# EAGLE design seven_seg_thermocouple_two (EAGLE 7.6.0)
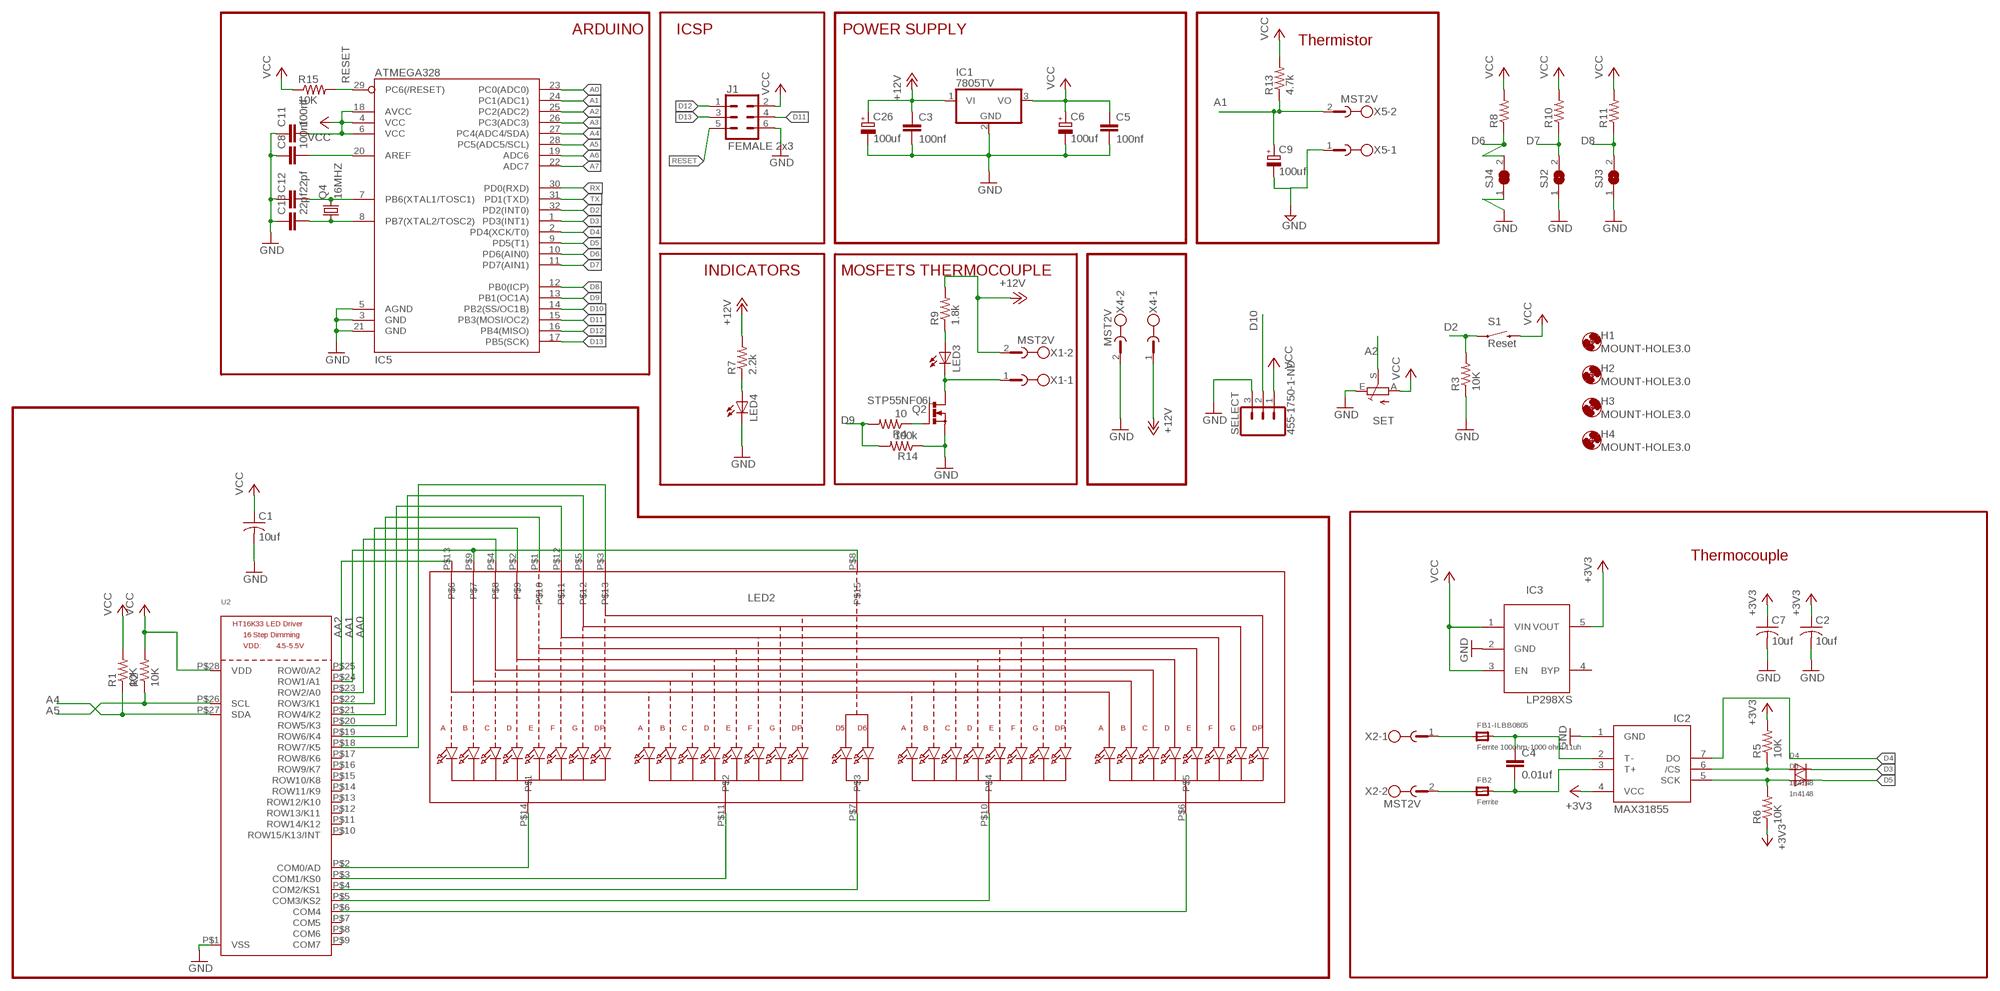
[diagram p0: schematic, sheet 1]

## Parts
C1  10uf  C-USC1206  [C1206]
C2  10uf  C-USC1206  [C1206]
C3  100nf  C-EUC1206  [C1206]
C4  0.01uf  C-EUC1206  [C1206]
C5  100nf  C-EUC1206  [C1206]
C6  100uf  CPOL-EUD  [PANASONIC_D]
C7  10uf  C-USC1206  [C1206]
C8  100nf  C-EUC1206  [C1206]
C9  100uf  CPOL-EUD  [PANASONIC_D]
C11  100nf  C-EUC1206  [C1206]
C12  22pf  C-EUC1206  [C1206]
C13  22pf  C-EUC1206  [C1206]
C26  100uf  CPOL-EUD  [PANASONIC_D]
D3  1n4148  DIODESOD-123  [SOD-123]
D4  1n4148  DIODESOD-123  [SOD-123]
FB1-ILBB0805  Ferrite 100ohm-1000 ohm 11uh  FERRITE_0805  [_0805]
FB2  Ferrite  FERRITE_0805  [_0805]
H1  MOUNT-HOLE3.0  [3,0]
H2  MOUNT-HOLE3.0  [3,0]
H3  MOUNT-HOLE3.0  [3,0]
H4  MOUNT-HOLE3.0  [3,0]
IC1  7805TV  [TO220V]
IC2  MAX31855  MAX6675  [SO08]
IC3  LP298XS  [SOT23-5L]
IC5  ATMEGA328  ATMEGA168  [TQFP32-08]
J1  FEMALE 2x3  CONN_03X2FEMALE  [2X3]
LED2  DISP_SEGMENT_4DIGIT_BL-Q56C43  [SEGMENT-BL-Q56C43]
LED3  LEDCHIPLED_1206  [CHIPLED_1206]
LED4  LEDCHIPLED_1206  [CHIPLED_1206]
Q2  STP55NF06L  IRF512  [TO220BV]
Q4  16MHZ  CRYSTALHC49S  [HC49/S]
R1  10K  R-US_R1206  [R1206]
R2  10K  R-US_R1206  [R1206]
R3  10K  R-US_R1206  [R1206]
R4  10  R-US_R1206  [R1206]
R5  10K  R-US_R1206  [R1206]
R6  10K  R-US_R1206  [R1206]
R7  2.2k  R-US_R1206  [R1206]
R8  R-US_R1206  [R1206]
R9  1.8k  R-US_R1206  [R1206]
R10  R-US_R1206  [R1206]
R11  R-US_R1206  [R1206]
R13  4.7k  R-US_R1206  [R1206]
R14  100k  R-US_R1206  [R1206]
R15  10K  R-US_R1206  [R1206]
S1  Reset  SWITCH-MOMENTARY-2SMD-ALT01  [TACTILE-SWITCH-SMD-ALT01]
SELECT  455-1750-1-ND  CONN_03  [1X03]
SET  TRIM_EU-B25U  [B25U]
SJ2  SJ  [SJ]
SJ3  SJ  [SJ]
SJ4  SOLDERJUMPER_CLOSED  [SOLDERJUMPER_CLOSEDWIRE]
U2  HT16K33_SOP28  [SOP28_300MIL]
X1  MST2V  [MSTBV2]
X2  MST2V  [MSTBV2]
X4  MST2V  [MSTBV2]
X5  MST2V  [MSTBV2]

## Nets
+3V3: C2.1 C7.1 IC2.4(VCC) IC3.5(VOUT) R5.2 R6.1
+12V [motors]: C3.1 C26.+ IC1.1(VI) R7.2 R9.2 X1.2 X4.1
A0: IC5.23(PC0(ADC0))
A1: C9.+ IC5.24(PC1(ADC1)) R13.1 X5.2
A2: IC5.25(PC2(ADC2)) SET.S
A3: IC5.26(PC3(ADC3))
A4: IC5.27(PC4(ADC4/SDA)) R1.1 U2.P$27(SDA)
A5: IC5.28(PC5(ADC5/SCL)) R2.1 U2.P$26(SCL)
A6: IC5.19(ADC6)
A7: IC5.22(ADC7)
AA0: LED2.P$4 U2.P$23(ROW2/A0)
AA1: LED2.P$8 LED2.P$9 U2.P$24(ROW1/A1)
AA2: LED2.P$13 U2.P$25(ROW0/A2)
CS: D4.A IC2.6(/CS) R5.1
D2: IC5.32(PD2(INT0)) R3.2 S1.1 S1.2
D3: D4.C IC5.1(PD3(INT1))
D4: IC2.7(DO) IC5.2(PD4(XCK/T0))
D5: D3.C IC5.9(PD5(T1))
D6: IC5.10(PD6(AIN0)) R8.1 SJ4.2
D7: IC5.11(PD7(AIN1)) R10.1 SJ2.2
D8: IC5.12(PB0(ICP)) R11.1 SJ3.2
D9: IC5.13(PB1(OC1A)) R4.2 R14.2
D10: IC5.14(PB2(SS/OC1B)) SELECT.2
D11: IC5.15(PB3(MOSI/OC2)) J1.4
D12: IC5.16(PB4(MISO)) J1.1
D13: IC5.17(PB5(SCK)) J1.3
GND [motors]: C1.2 C2.2 C3.2 C5.2 C6.- C7.2 C8.1 C9.- C11.1 C12.1 C13.1 C26.- IC1.2(GND) IC2.1(GND) IC3.2(GND) IC5.3(GND) IC5.5(AGND) IC5.21(GND) J1.6 LED4.C Q2.S R3.1 R14.1 SELECT.3 SET.E SJ2.1 SJ3.1 SJ4.1 U2.P$1(VSS) X4.2 X5.1
N$1: FB1-ILBB0805.1 X2.1
N$2: LED2.P$14 U2.P$2(COM0/AD)
N$3: LED2.P$11 U2.P$3(COM1/KS0)
N$4: LED2.P$7 U2.P$4(COM2/KS1)
N$5: LED2.P$10 U2.P$5(COM3/KS2)
N$6: LED2.P$6 U2.P$6(COM4)
N$7 [motors]: LED3.C Q2.D X1.1
N$8: C4.1 FB1-ILBB0805.2 IC2.2(T-)
N$9: FB2.1 X2.2
N$10: LED2.P$2 U2.P$22(ROW3/K1)
N$11: LED2.P$1 U2.P$21(ROW4/K2)
N$12: LED2.P$12 U2.P$20(ROW5/K3)
N$13: LED2.P$5 U2.P$19(ROW6/K4)
N$14: C4.2 FB2.2 IC2.3(T+)
N$16: LED2.P$3 U2.P$18(ROW7/K5)
N$20: C8.2 IC5.20(AREF)
N$26: LED4.A R7.1
N$31: C12.2 IC5.7(PB6(XTAL1/TOSC1)) Q4.2
N$32: C13.2 IC5.8(PB7(XTAL2/TOSC2)) Q4.1
N$45: LED3.A R9.1
N$47: Q2.G R4.1
RESET: IC5.29(PC6(/RESET)) J1.5 R15.2
RX: IC5.30(PD0(RXD))
SCK: D3.A IC2.5(SCK) R6.2
TX: IC5.31(PD1(TXD))
VCC: C1.1 C5.1 C6.+ C11.2 IC1.3(VO) IC3.1(VIN) IC3.3(EN) IC5.4(VCC) IC5.6(VCC) IC5.18(AVCC) J1.2 R1.2 R2.2 R8.2 R10.2 R11.2 R13.2 R15.1 S1.3 S1.4 SELECT.1 SET.A U2.P$28(VDD)
Unconnected: IC3.4(BYP) U2.P$7(COM5) U2.P$8(COM6) U2.P$9(COM7) U2.P$10(ROW15/K13/INT) U2.P$11(ROW14/K12) U2.P$12(ROW13/K11) U2.P$13(ROW12/K10) U2.P$14(ROW11/K9) U2.P$15(ROW10/K8) U2.P$16(ROW9/K7) U2.P$17(ROW8/K6)

## Notes on the sheet
- ARDUINO | ICSP | POWER SUPPLY
- Thermistor
- INDICATORS | MOSFETS THERMOCOUPLE
- Thermocouple

## Library data of the parts
C1 C2 C7 = resistor:C-US: CAPACITOR, American symbol
C3-C5 C8 C11-C13 = resistor:C-EU: CAPACITOR, European symbol
C6 C9 C26 = resistor:CPOL-EU: POLARIZED CAPACITOR, European symbol
D3 D4 = adafruit:DIODE: Diode SMADIODE - SMA Surface Mount Package 20V 1A Schottky Diode Digikey: 641-1014-6-ND DO-1N4148 - Through Hole Small Current Diode SOD-123 20V 1 A (.5mV Vf) Schottky Diode - Digikey: MBRX120TPMSCT-ND SOD-323 10V 570mA (.38mV Vf, 3ns) Schottky Diode - Digikey: ZLLS410CT-ND SOD-523 30V 30mA Schottky Diode (RB751S-40TE61) - Digikey: RB751S-40TE61CT-ND SOT23-R/W - SOT23 Package (R = Solder Paste/Reflow Ovens, W = Hand-Soldering) BAT54Film 40V 300mA - Digikey: 497-7162-1-ND
FB1-ILBB0805 FB2 = microbuilder:FERRITE: Ferrite Bead 0603 MMZ1608B121C - 120 Ohm @ 100MHz, 600mA, 0.15 Ohm DC Resistance - Digikey: 445-2164-1-ND BK1608HW121-T - 120 Ohm, 600mA Ferrite Chip - Digikey: 587-1876-2-ND 0805 HZ0805B272R-10 - 2.7K Ohm @ 100MHz, 200mA, 0.8 Ohm DC Resistance - Digikey: 240-2504-1-ND (see also Murata BLM21BD272SN1L) MMZ2012Y152B - 1.5K Ohm @ 100MHz, 500mA, 0.4 Ohm DC Resistance - Digikey: 445-1560-1-ND - Mainly for high frequency (80-400MHz) MMZ2012R102A - 1K Ohm @ 100MHz, 500mA, 0.3 Ohm DC Resistance - Digikey: 445-1555-2-ND - More general purpose (10-200MHz)
H1-H4 = holes:MOUNT-HOLE: MOUNTING HOLE with drill center marker
IC1 = linear:78*: Positive VOLTAGE REGULATOR Source: http://cache.national.com/ds/LM/LM78L05.pdf http://www.fairchildsemi.com/ds/LM/LM7805.pdf
IC2 = adafruit:MAX6675
IC3 = adafruit:LP298X
IC5 = SparkFun:ATMEGA168
J1 = SparkFun-Connectors:CONN_03X2: Multi connection point. Often used as Generic Header-pin footprint for 0.1 inch spaced/style header connections You can populate with any combo of single row headers, but if you'd like an exact match, check these: Header - 2x3 (Male, 0.1") <https://www.sparkfun.com/products/12807> (PRT-12807) Header - 2x3 (Female, 0.1") <https://www.sparkfun.com/products/13010> (PRT-13010) 2x3 Pin Shrouded Header <https://www.sparkfun.com/products/10877> (PRT-10877) On any of the 0.1 inch spaced packages, you can populate with these: Break Away Headers - Straight <https://www.sparkfun.com/products/116> (PRT-00116) Break Away Male Headers - Right Angle <https://www.sparkfun.com/products/553> (PRT-00553) Female Headers <https://www.sparkfun.com/products/115> (PRT-00115) Break Away Headers - Machine Pin <https://www.sparkfun.com/products/117> (PRT-00117) Break Away Female Headers - Swiss Machine Pin <https://www.sparkfun.com/products/743> (PRT-00743) Special note: the shrouded connector mates well with our 3x2 ribbon cables: Ribbon Crimp Connector - 6-pin (2x3, Female) <https://www.sparkfun.com/products/10651> (PRT-10651) Ribbon Cable - 6 wire (15ft) <https://www.sparkfun.com/products/10646> (PRT-10646); PROD_ID: CONN-11566
LED2 = microbuilder:DISP_SEGMENT_4DIGIT_BL-Q56C43
LED3 LED4 = led:LED: LED OSRAM: - CHIPLED LG R971, LG N971, LY N971, LG Q971, LY Q971, LO R971, LY R971 LH N974, LH R974 LS Q976, LO Q976, LY Q976 LO Q996 - Hyper CHIPLED LW Q18S LB Q993, LB Q99A, LB R99A - SideLED LS A670, LO A670, LY A670, LG A670, LP A670 LB A673, LV A673, LT A673, LW A673 LH A674 LY A675 LS A676, LA A676, LO A676, LY A676, LW A676 LS A679, LY A679, LG A679 - Hyper Micro SIDELED® LS Y876, LA Y876, LO Y876, LY Y876 LT Y87S - SmartLED LW L88C, LW L88S LB L89C, LB L89S, LG L890 LS L89K, LO L89K, LY L89K LS L896, LA L896, LO L896, LY L896 - TOPLED LS T670, LO T670, LY T670, LG T670, LP T670 LSG T670, LSP T670, LSY T670, LOP T670, LYG T670 LG T671, LOG T671, LSG T671 LB T673, LV T673, LT T673, LW T673 LH T674 LS T676, LA T676, LO T676, LY T676, LB T676, LH T676, LSB T676, LW T676 LB T67C, LV T67C, LT T67C, LS T67K, LO T67K, LY T67K, LW E67C LS E67B, LA E67B, LO E67B, LY E67B, LB E67C, LV E67C, LT E67C LW T67C LS T679, LY T679, LG T679 LS T770, LO T770, LY T770, LG T770, LP T770 LB T773, LV T773, LT T773, LW T773 LH T774 LS E675, LA E675, LY E675, LS T675 LS T776, LA T776, LO T776, LY T776, LB T776 LHGB T686 LT T68C, LB T68C - Hyper Mini TOPLED® LB M676 - Mini TOPLED Santana® LG M470 LS M47K, LO M47K, LY M47K Source: http://www.osram.convergy.de LUXEON: - LUMILED® LXK2-PW12-R00, LXK2-PW12-S00, LXK2-PW14-U00, LXK2-PW14-V00 LXK2-PM12-R00, LXK2-PM12-S00, LXK2-PM14-U00 LXK2-PE12-Q00, LXK2-PE12-R00, LXK2-PE12-S00, LXK2-PE14-T00, LXK2-PE14-U00 LXK2-PB12-K00, LXK2-PB12-L00, LXK2-PB12-M00, LXK2-PB14-N00, LXK2-PB14-P00, LXK2-PB14-Q00 LXK2-PR12-L00, LXK2-PR12-M00, LXK2-PR14-Q00, LXK2-PR14-R00 LXK2-PD12-Q00, LXK2-PD12-R00, LXK2-PD12-S00 LXK2-PH12-R00, LXK2-PH12-S00 LXK2-PL12-P00, LXK2-PL12-Q00, LXK2-PL12-R00 Source: www.luxeon.com KINGBRIGHT: KA-3528ASYC Source: www.kingbright.com
Q2 = transistor-power:IRF512: N-CHANNEL MOS FET
Q4 = crystal:CRYSTAL: CRYSTAL
R1-R11 R13-R15 = resistor:R-US_: RESISTOR, American symbol
S1 = Testing:SWITCH-MOMENTARY-2: Various NO switches- pushbuttons, reed, etc
SELECT = SparkFun-Connectors:CONN_03: Multi connection point. Often used as Generic Header-pin footprint for 0.1 inch spaced/style header connections On any of the 0.1 inch spaced packages, you can populate with these: Break Away Headers - Straight <https://www.sparkfun.com/products/116> (PRT-00116) Break Away Male Headers - Right Angle <https://www.sparkfun.com/products/553> (PRT-00553) Female Headers <https://www.sparkfun.com/products/115> (PRT-00115) Break Away Headers - Machine Pin <https://www.sparkfun.com/products/117> (PRT-00117) Break Away Female Headers - Swiss Machine Pin <https://www.sparkfun.com/products/743> (PRT-00743) Stackable Header - 3 Pin (Female, 0.1") <https://www.sparkfun.com/products/13875> (PRT-13875) For SCREWTERMINALS and SPRING TERMINALS visit here: Screw Terimnals on SparkFun.com <https://www.sparkfun.com/search/results?term=Screw+Terminals> (5mm/3.5mm/2.54mm spacing) This device is also useful as a general connection point to wire up your design to another part of your project. Our various solder wires solder well into these plated through hole pads. Hook-Up Wire - Assortment (Stranded, 22 AWG) <https://www.sparkfun.com/products/11375> (PRT-11375) Hook-Up Wire - Assortment (Solid Core, 22 AWG) <https://www.sparkfun.com/products/11367> (PRT-11367) View the entire wire category on our website here <https://www.sparkfun.com/categories/141> Special notes: Molex polarized connector foot print use with SKU : PRT-08232 with associated crimp pins and housings.; PROD_ID: XXX-00000
SET = pot:TRIM_EU-: POTENTIOMETER
SJ2 SJ3 = jumper:SJ: SMD solder JUMPER
SJ4 = microbuilder:SOLDERJUMPER_CLOSED: Solder Jumper - Closed These solder jumpers are closed by default CLOSEDWIRE - 10 mil trace between pads that can be cut and resoldered later CLOSEDPERM - 63 mil trace between pads for a permanent connection (used to 'bridge' two signals, a shameless hack for Eagle). Can double as a test point as well (no cream layer)
U2 = microbuilder:HT16K33_SOP28
X1 X2 X4 X5 = con-phoenix-508:MST2V: PHOENIX

## Net classes
2 motors: width 1.016 mm

## Board
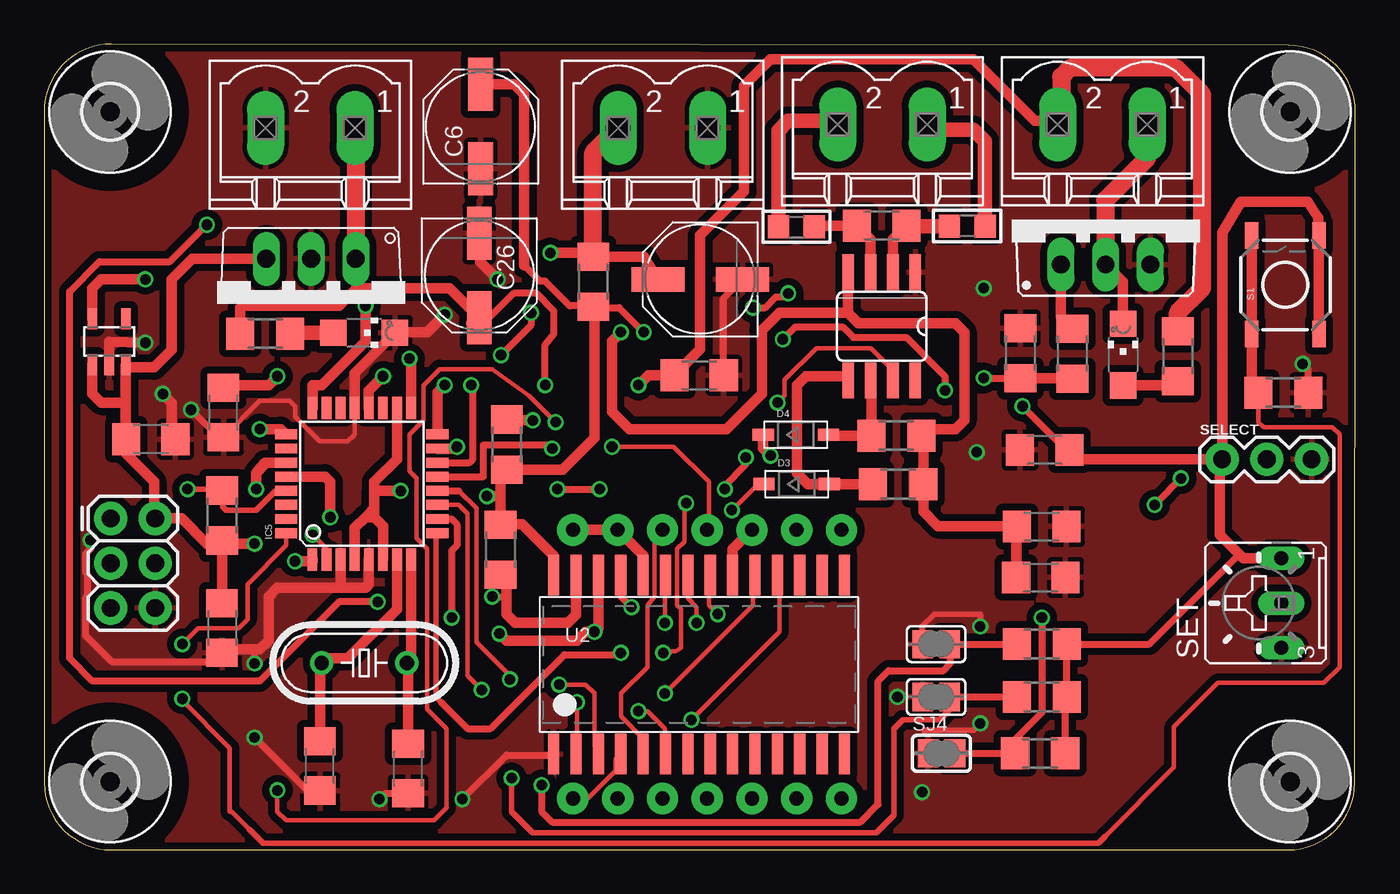
[diagram p1: board, top side]
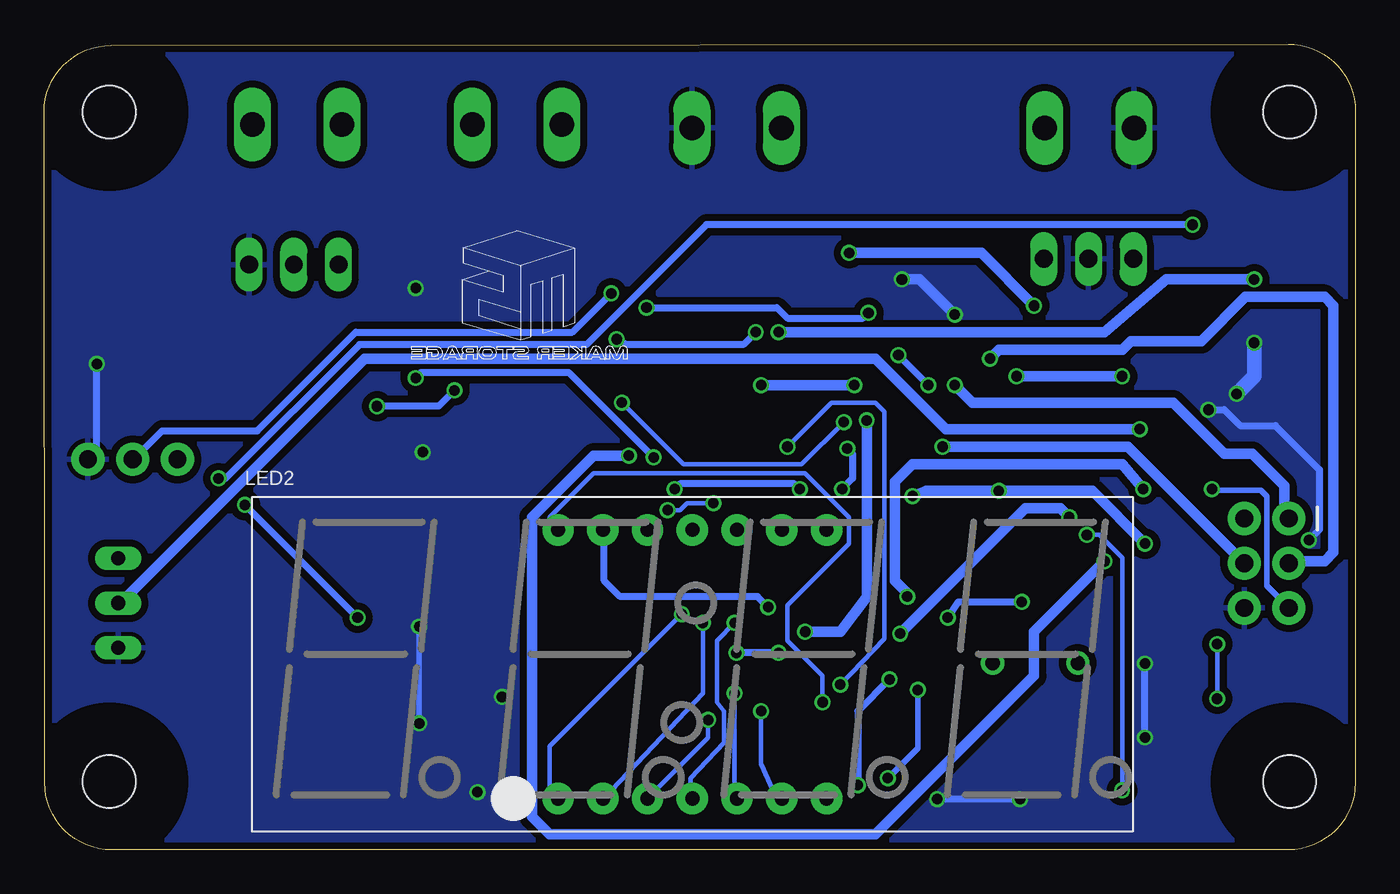
[diagram p2: board, bottom side, seen from below]

Size 74.45 x 45.73 mm. Coordinates in mm from the lower left corner, seen from the top.
Outline: 0,41.92 0.01,3.82 arc90 3.82,0 70.6,0 arc90 74.41,3.81 74.45,41.85 arc90 70.64,45.66 3.81,45.73 arc90 0,41.92
Copper layers (1*16): Top 0.035mm / dielectric 1.5mm / Bottom 0.035mm
Design rules "SeeedStudio_2layer_DRU_no_angle_20140221": minimum track width 6mil, minimum drill 12mil, track to track 6mil, track to pad 6mil, pad to pad 6mil, via to via 6mil, smd to smd 0mil, copper to edge 10mil, drill to drill 10mil, minimum pad ring 10mil, minimum via ring 6mil, stop-mask expansion 2mil, vias tented up to drill 100mil, thermal gap 10mil

### Footprints (pad centres in the part's own frame; a part is rotated, then mirrored left to right if it is on the bottom)
C1206 = smd 1.6 x 1.8: 1 -1.4,0; 2 1.4,0
PANASONIC_D = smd 3 x 1.4: + 2.4,0; - -2.4,0
SOD-123 = smd 1.2 x 0.7: A 1.85,0; C -1.85,0
_0805 = smd 1.2 x 1.3: 1 -1.016,0; 2 1.016,0
3,0 = hole 3: 0,0
TO220V = drill 1.016 long: 1 -2.54,-2.54; 2 0,-2.54; 3 2.54,-2.54
SO08 = smd 0.66 x 2.032: 1 -1.905,-3.073; 2 -0.635,-3.073; 3 0.635,-3.073; 4 1.905,-3.073; 5 1.905,3.073; 6 0.635,3.073; 7 -0.635,3.073; 8 -1.905,3.073
SOT23-5L = smd 0.55 x 1.2: 1 -0.95,-1.3; 2 0,-1.3; 3 0.95,-1.3; 4 0.95,1.3; 5 -0.95,1.3
TQFP32-08 = smd 1.27 x 0.559: 1 -4.293,2.8; 2 -4.293,2; 3 -4.293,1.2; 4 -4.293,0.4; 5 -4.293,-0.4; 6 -4.293,-1.2; 7 -4.293,-2; 8 -4.293,-2.8; 17 4.293,-2.8; 18 4.293,-2; 19 4.293,-1.2; 20 4.293,-0.4; 21 4.293,0.4; 22 4.293,1.2; 23 4.293,2; 24 4.293,2.8 | smd 0.559 x 1.27: 9 -2.8,-4.293; 10 -2,-4.293; 11 -1.2,-4.293; 12 -0.4,-4.293; 13 0.4,-4.293; 14 1.2,-4.293; 15 2,-4.293; 16 2.8,-4.293; 25 2.8,4.293; 26 2,4.293; 27 1.2,4.293; 28 0.4,4.293; 29 -0.4,4.293; 30 -1.2,4.293; 31 -2,4.293; 32 -2.8,4.293
2X3 = drill 1.016 pad 1.88: 1 0,0; 2 0,2.54; 3 2.54,0; 4 2.54,2.54; 5 5.08,0; 6 5.08,2.54
SEGMENT-BL-Q56C43 = drill 0.8 pad 1.778: P$1 -7.62,-7.62; P$2 -5.08,-7.62; P$3 -2.54,-7.62; P$4 0,-7.62; P$5 2.54,-7.62; P$6 5.08,-7.62; P$7 7.62,-7.62; P$8 7.62,7.62; P$9 5.08,7.62; P$10 2.54,7.62; P$11 0,7.62; P$12 -2.54,7.62; P$13 -5.08,7.62; P$14 -7.62,7.62
CHIPLED_1206 = smd 1.5 x 1.5: A 0,-1.75; C 0,1.75
TO220BV = drill 1.016 long: D 0,-2.54; G -2.54,-2.54; S 2.54,-2.54
HC49/S = drill 0.813: 1 -2.413,0; 2 2.413,0
R1206 = smd 1.6 x 1.803: 1 -1.422,0; 2 1.422,0
TACTILE-SWITCH-SMD-ALT01 = smd 1.524 x 0.762: 1 -2.794,1.905; 2 2.794,1.905; 3 -2.794,-1.905; 4 2.794,-1.905
1X03 = drill 1.016 pad 1.88: 1 0,0; 2 2.54,0; 3 5.08,0
B25U = drill 0.813 long: A 2.54,-0.889; E -2.54,-0.889; S 0,-0.889
SJ = smd 1.168 x 1.6: 1 -0.762,0; 2 0.762,0
SOLDERJUMPER_CLOSEDWIRE = smd 1.168 x 1.6: 1 -0.762,0; 2 0.762,0 | smd 0.635 x 0.203: WIRE 0,0
SOP28_300MIL = smd 0.635 x 2.286: P$1 -8.255,-5.08; P$2 -6.985,-5.08; P$3 -5.715,-5.08; P$4 -4.445,-5.08; P$5 -3.175,-5.08; P$6 -1.905,-5.08; P$7 -0.635,-5.08; P$8 0.635,-5.08; P$9 1.905,-5.08; P$10 3.175,-5.08; P$11 4.445,-5.08; P$12 5.715,-5.08; P$13 6.985,-5.08; P$14 8.255,-5.08; P$15 8.255,5.08; P$16 6.985,5.08; P$17 5.715,5.08; P$18 4.445,5.08; P$19 3.175,5.08; P$20 1.905,5.08; P$21 0.635,5.08; P$22 -0.635,5.08; P$23 -1.905,5.08; P$24 -3.175,5.08; P$25 -4.445,5.08; P$26 -5.715,5.08; P$27 -6.985,5.08; P$28 -8.255,5.08
MSTBV2 = drill 1.397 long: 1 -2.54,0; 2 2.54,0

### Placement (x,y rotation side)
C1  56.81,22.7 180 top
C2  56.64,18.36 0 top
C3  37.19,26.94 0 top
C4  47.56,35.42 180 top
C5  10.11,12.59 270 top
C6  24.79,41.05 90 top
C7  56.59,15.46 0 top
C8  10.19,24.82 90 top
C9  37.25,32.38 180 top
C11  6.06,23.3 180 top
C12  15.67,4.77 90 top
C13  20.67,4.62 90 top
C26  24.71,32.6 270 top
D3  42.73,20.76 0 top
D4  42.68,23.56 0 top
FB1-ILBB0805  52.41,35.4 180 top
FB2  42.71,35.36 0 top
H1  3.75,41.88 0 top
H2  3.75,3.88 0 top
H3  70.75,3.88 0 top
H4  70.75,41.88 0 top
IC1  15.16,31 180 top
IC2  47.56,29.71 180 top
IC3  3.7,28.84 0 top
IC5  18.04,20.78 90 top
J1  3.78,18.81 270 top
LED2  37.65,10.54 0 bottom
LED3  61.26,28.11 0 top
LED4  18.18,29.35 270 top
Q2  60.27,35.76 0 top
Q4  18.18,10.61 180 top
R1  25.92,17.04 90 top
R2  26.28,23 270 top
R3  70.35,25.95 180 top
R4  58.38,28.16 270 top
R5  48.39,23.51 0 top
R6  48.49,20.75 180 top
R7  12.56,29.3 180 top
R8  56.55,5.48 0 top
R9  64.37,28.02 90 top
R10  56.65,8.68 0 top
R11  56.65,11.68 0 top
R13  31.18,32.24 270 top
R14  55.43,28.19 270 top
R15  10.12,18.98 90 top
S1  70.47,32.07 90 top
SELECT  66.88,22.16 0 top
SET  69.35,14.01 90 top
SJ2  50.65,8.68 0 top
SJ3  50.65,11.68 0 top
SJ4  50.95,5.48 0 top
U2  37.19,10.52 0 top
X1  60.09,41.17 180 top
X2  47.6,41.17 180 top
X4  15.12,40.97 180 top
X5  35.13,40.97 180 top

### Tracks (layer width: path | path; a pad name or v marks a point on that pad's centre or on a via)
+3V3  (via drill 0.6)
  Top 0.61: C7.1 55.19,18.31 C2.1 55.22,18.38 50.75,18.38 49.91,19.21 R6.1 49.91,23.41 R5.2 50.18,23.88 51.75,23.88 52.25,24.38 52.25,29.38 51.75,29.88 46.25,29.88 45.65,30.47 | IC2.4 45.65,30.47 | 45.65,30.47 41.74,30.47 40.75,29.48 40.75,25.88 38.75,23.88 33.25,23.88 32.25,24.88 32.25,28.88 v32.75,29.38 | v5.75,32.38 3.25,32.38 2.75,31.88 IC3.5
  Bottom 0.61: v5.75,32.38 10.75,32.38 14.25,29.38 v32.75,29.38
+12V  (via drill 0.6)
  Top 0.406: v28.45,26.38 28.45,28.68 28.95,29.28 28.95,30.58 27.95,31.58 26.65,31.58 25.35,30.28 24.79,30.28 C26.+
  Top 0.61: R7.2 11.13,30.76 11.25,30.88 16.75,30.88 17.75,31.88 | 17.75,31.88 17.75,33.49 IC1.1 | 17.75,31.88 23.03,31.88 C26.+ 24.25,29.88 | X1.2 57.34,41.38 56.25,41.38 52.75,44.88 41.25,44.88 39.75,43.38 39.75,37.38 37.25,34.88 37.25,28.4 C3.1 34.31,26.94 v33.75,26.38
  Top 1.016: X4.1 17.7,40.97 IC1.1 | R9.2 64.37,30.5 65.75,31.88 65.75,42.88 64.25,44.38 58.25,44.38 57.75,43.88 57.75,41.37 X1.2
  Bottom 0.61: v28.45,26.38 v33.75,26.38
A1  (via drill 0.6)
  Top 0.61: C9.+ 34.06,33.66 R13.1 30.75,33.88 v28.75,33.88 | v18.25,30.88 18.25,28.88 15.75,26.38 15.25,26.38 15.25,25.38 IC5.24
  Top 1.016: R13.1 31.18,39.56 X5.2
  Bottom 0.61: v18.25,30.88 21.25,33.88 v28.75,33.88
A2  (via drill 0.6)
  Top 0.61: v12.25,23.88 13.44,23.88 IC5.25
  Bottom 0.61: v12.25,23.88 23.25,23.88 27.25,27.88 56.25,27.88 69.75,14.38 SET.S
A4  (via drill 0.6)
  Top 0.406: v25.45,14.38 26.15,14.38 26.25,14.48
  Top 0.61: U2.P$27 30.2,13.33 29.75,12.88 26.75,12.88 26.25,13.38 26.25,14.48 26.25,15.28 R1.1 | v12.05,20.48 12.05,21.38 12.55,21.98 IC5.27
  Bottom 0.61: v12.05,20.48 13.25,21.88 25.15,21.88 26.15,20.88 26.15,15.28 25.45,14.58 v25.45,14.38
A5  (via drill 0.6)
  Top 0.61: v27.75,24.38 26.25,24.38 R2.1 | U2.P$26 31.47,12.6 v31.25,12.38 30.75,12.38 30.25,11.88 26.25,11.88 v25.85,12.28 | IC5.28 15.95,21.18 16.25,20.88 v16.25,18.88
  Bottom 0.61: v27.75,24.38 27.75,14.38 29.25,12.38 v31.25,12.38 | v25.85,12.28 18.75,19.38 16.75,19.38 v16.25,18.88
AA0  (via drill 0.6)
  Top 0.254: v35.25,12.88 35.25,15.38 U2.P$23
  Bottom 0.254: v35.25,12.88 36.25,11.88 36.25,8.38 35.85,7.88 35.85,6.08 37.75,4.08 37.75,3.38 LED2.P$4
AA1
  Top 0.61: LED2.P$8 LED2.P$9 34.01,16.71 U2.P$24
AA2  (via drill 0.6)
  Top 0.406: v33.35,13.78 32.75,14.38 32.75,15.58 U2.P$25
  Bottom 0.406: v33.35,13.78 33.95,14.38 41.75,14.38 42.65,15.28 42.65,18.08 LED2.P$13
CS
  Top 0.61: IC2.6 46.96,26.59 R5.1 44.58,23.51 D4.A
D2  (via drill 0.6)
  Top 0.254: IC5.32 13.74,17.27 11.55,15.08 11.55,13.08 11.05,12.58 8.75,12.58 v7.85,11.68 | 7.85,8.68 v7.85,8.58 7.85,8.48 10.55,5.78 10.55,2.18 10.65,2.18 11.65,1.18 | 60.25,0.78 64.15,4.68 64.15,6.98 66.65,9.48 72.65,9.48 73.55,10.38 73.55,23.58 73.15,23.98 69.25,23.98 68.95,24.28 68.95,25.92 R3.2
  Top 0.305: 11.65,1.18 12.45,0.38 59.85,0.38 60.25,0.78
  Top 0.61: S1.2 S1.1 68.56,26.31 R3.2
  Bottom 0.254: v7.85,11.68 v7.85,8.58
D3  (via drill 0.6)
  Top 0.61: v14.25,16.38 15.25,16.38 IC5.1 | D4.C 40.83,22.8 v41.25,22.38
  Bottom 0.61: v14.25,16.38 18.25,12.38 18.25,9.88 27.25,0.88 45.75,0.88 46.75,1.88 46.75,18.88 43.25,22.38 v41.25,22.38
D4  (via drill 0.6)
  Top 0.254: v13.25,3.38 13.25,2.18 13.75,1.68 22.15,1.68 22.85,2.38 22.85,6.88 21.75,7.98 21.75,17.08 21.15,17.68 21.15,21.08 20.75,21.48 20.75,23.58 21.55,24.38 21.55,26.38 22.45,27.28 25.45,27.28 27.55,25.78 v29.05,24.28 | v15.25,17.88 16.05,17.08 16.05,16.58 IC5.2 | v41.65,25.38 42.05,25.78 42.05,26.68 43.85,28.48 46.95,28.48 48.15,27.28 48.15,26.68 IC2.7
  Bottom 0.254: v13.25,3.38 13.25,16.58 14.55,17.88 v15.25,17.88 | v41.65,25.38 38.15,21.88 31.45,21.88 v29.05,24.28
D5  (via drill 0.6)
  Top 0.254: v35.15,11.18 35.55,11.18 35.65,11.28 35.85,11.28 36.05,11.38 36.15,11.48 36.15,13.68 35.95,13.88 35.95,17.08 36.35,17.48 36.35,19.68 v36.45,19.68 | v39.05,19.28 40.55,20.78 40.85,20.78 D3.C
  Top 0.305: 22.55,8.38 22.25,8.68 22.25,17.89 IC5.9
  Top 0.406: 22.35,17.98 IC5.9 | 22.55,8.38 24.05,6.88 25.35,6.88 29.55,11.08 32.65,11.08 v32.75,11.18 | v35.15,11.18 35.35,11.18
  Bottom 0.254: v39.05,19.28 38.35,19.28 37.95,19.68 v36.45,19.68
  Bottom 0.406: v32.75,11.18 v35.15,11.18
D6  (via drill 0.6)
  Top 0.152: SJ4.2
  Top 0.406: 51.45,5.48 51.55,5.58 51.65,5.48 SJ4.2 R8.1 55.15,5.68 55.15,6.28 56.65,7.78 v56.65,13.18 | v64.55,21.08 v63.05,19.58 | v9.25,35.48 7.15,33.38 3.15,33.38 1.45,31.68 1.45,10.88 2.75,9.58 12.25,9.58 16.75,14.08 v18.95,14.08 | v23.15,13.18 23.15,16.98 23.45,17.28 23.45,18.48 23.15,18.78 IC5.10
  Bottom 0.406: v63.05,19.58 v56.65,13.18 | v64.55,21.08 64.15,21.08 56.55,28.68 43.65,28.68 36.85,35.48 v9.25,35.48 | v18.95,14.08 22.55,14.08 v23.15,13.18
D7  (via drill 0.6)
  Top 0.254: IC5.11 23.55,19.58 24.05,19.08 24.05,9.88 v24.85,9.08
  Top 0.305: v26.55,4.08 26.55,2.18 27.75,0.98 47.25,0.98 48.25,1.98 48.25,6.88 48.75,7.38 50.85,7.38 51.35,7.88 51.35,8.61 SJ2.2
  Top 0.406: R10.1 51.55,8.68 51.45,8.78 51.35,8.68 SJ2.2 | v24.85,9.08 24.85,9.28
  Bottom 0.305: v24.85,9.08 24.85,5.78 v26.55,4.08
D8  (via drill 0.6)
  Top 0.254: 23.55,20.38 24.55,19.38 24.55,11.78 26.45,9.88
  Top 0.406: R11.1 51.55,11.68 51.45,11.78 51.35,11.68 SJ3.2 51.45,11.64 51.45,10.58 51.05,10.18 47.95,10.18 47.35,9.58 47.35,2.58 46.35,1.58 28.85,1.58 28.25,2.18 v28.25,3.68 | IC5.12 23.55,20.38 | v26.45,9.68 26.45,9.88
  Bottom 0.406: v28.25,3.68 28.25,7.88 v26.45,9.68
D9  (via drill 0.6)
  Top 0.406: IC5.13 24.95,21.18 24.95,22.98 28.65,22.98 v28.85,22.78 | v53.35,26.78 55.15,26.78 R14.2 | v39.85,22.28 39.85,21.88 38.65,20.68 v38.65,20.48 | v29.15,20.48 v31.55,20.48
  Top 0.61: R14.2 58.35,26.76 R4.2
  Bottom 0.406: v53.35,26.78 53.05,27.08 44.65,27.08 v39.85,22.28 | v38.65,20.48 38.35,20.78 31.85,20.78 v31.55,20.48 | v29.15,20.48 28.55,21.08 28.55,22.48 v28.85,22.78
D10  (via drill 0.6)
  Top 0.406: IC5.14 24.15,21.98 24.35,22.18 24.35,25.98 24.15,26.18 24.25,26.28 v24.25,26.38 | v40.25,30.78 40.95,30.78 41.55,31.38 42.05,31.38 v42.25,31.58 | v27.65,30.48 27.65,29.78 v25.95,28.08
  Bottom 0.406: v40.25,30.78 32.85,30.78 32.25,30.18 27.95,30.18 v27.65,30.48 | v42.25,31.58 44.45,29.38 56.75,29.38 62.35,23.78 67.75,23.78 69.35,22.18 SELECT.2 | v25.95,28.08 v24.25,26.38
D11  (via drill 0.6)
  Top 0.61: IC5.15 23.35,22.78 v23.45,22.88
  Bottom 0.61: v23.45,22.88 12.93,22.88 J1.4 6.75,16.38
D12  (via drill 0.6)
  Top 0.61: IC5.16 22.33,25.96 v22.75,26.38
  Bottom 0.61: v22.75,26.38 21.75,25.38 10.35,25.38 7.45,22.48 5.85,22.48 4.05,20.68 4.05,19.08 J1.1 4.25,18.88
D13  (via drill 0.6)
  Top 0.61: IC5.17 20.84,27.79 v20.75,27.88
  Bottom 0.61: J1.3 3.75,16.38 1.75,16.38 1.25,16.88 1.25,30.88 1.75,31.38 6.25,31.38 8.75,28.88 12.75,28.88 13.25,28.38 20.25,28.38 v20.75,27.88
GND  (via drill 0.6)
  Top 0.254: IC5.21 17.64,23.57 17.25,23.18 15.65,23.18 14.25,24.58 14.25,25.18 13.95,25.48 12.25,25.48 C8.1
  Top 0.305: 49.98,6.71 50.05,6.78 52.75,6.78 v53.15,7.18 | v53.15,12.68 53.15,13.38 50.55,13.38 49.85,12.68 49.85,11.68 SJ3.1
  Top 0.406: v11.95,10.58 11.95,11.38 | v11.95,6.38 14.95,3.38 15.65,3.38 C12.1 | v2.65,17.58 2.65,17.08 2.35,16.78 2.35,15.78 2.45,15.68 2.45,14.38 2.35,14.28 2.35,12.18 3.85,10.68 9.6,10.68 C5.2 9.85,11.18 | v8.35,24.98 9.45,23.88 9.45,23.48 9.55,23.38 10.15,23.38 C8.1 | v71.45,27.58 71.75,27.28 71.75,25.98 R3.1 | v23.75,2.88 26.25,5.38 28.85,5.38 U2.P$1 | v19.05,2.88 19.35,3.18 20.65,3.18 C13.1 | C3.2 38.59,31.32 C9.-
  Top 0.61: IC5.5 18.44,15.07 18.25,14.88 16.75,14.88 | 16.75,14.88 13.25,14.88 12.75,14.38 12.75,11.88 12.25,11.38 11.95,11.38 10.3,11.38 C5.2 | IC5.3 16.84,14.97 16.75,14.88 | IC5.21 17.64,27.06 LED4.C 20.25,29.38 21.75,29.38 v22.75,30.38 | v6.75,25.88 7.25,25.38 7.25,23.38 C11.1 | IC3.2 3.7,28.83 v5.75,28.78 | v25.75,32.38 24.75,33.38 24.75,34.88 C26.-
  Bottom 0.305: v53.15,7.18 v53.15,12.68
  Bottom 0.406: v11.95,6.38 v11.95,10.58 | v2.65,17.58 2.05,18.18 2.05,21.58 4.55,24.08 6.55,24.08 7.45,24.98 v8.35,24.98 | v71.45,27.58 71.45,22.68 71.95,22.18 SELECT.3 | v19.05,2.88 v23.75,2.88
  Bottom 0.61: v25.75,32.38 24.75,32.38 v22.75,30.38
  Bottom 0.813: v5.75,28.78 5.75,26.88 v6.75,25.88
  other vias: 52.95,22.58 53.35,31.88 48.45,8.68 49.85,3.28
  pour Top (isolate 0.406): -4.25,50.38 78.75,50.38 78.85,-6.42 -4.15,-6.42
  pour Bottom (isolate 0.406): -2.35,-4.52 76.65,-4.52 76.75,48.38 -2.25,48.38
N$1
  Top 0.813: FB1-ILBB0805.1 53.42,40.2 52.75,40.88 50.43,40.88 X2.1
N$2  (via drill 0.6)
  Top 0.254: v30.25,8.38 30.25,5.88 U2.P$2
  Bottom 0.254: v30.25,8.38 30.25,9.88 32.25,11.88 32.25,13.88 28.75,17.38 28.75,18.88 31.25,21.38 43.25,21.38 45.75,18.88 45.75,18.38 LED2.P$14
N$3  (via drill 0.6)
  Top 0.254: v32.25,22.88 35.75,22.88 37.75,20.88 37.75,18.38 LED2.P$11 | v29.25,9.38 30.75,9.38 31.25,8.88 31.25,5.88 U2.P$3
  Bottom 0.254: v32.25,22.88 29.75,25.38 27.25,25.38 26.75,24.88 26.75,11.98 v29.25,9.38
N$4
  Top 0.254: LED2.P$7 30.89,2.92 32.45,4.48 32.45,5.14 U2.P$4
N$5
  Top 0.254: LED2.P$10 35.11,17.74 34.65,17.38 34.65,14.38 34.25,13.88 34.25,10.38 32.75,8.88 32.75,7.58 34.05,6.28 34.05,5.47 U2.P$5
N$6  (via drill 0.6)
  Top 0.254: v33.75,7.88 34.25,7.88 35.25,6.88 35.25,5.88 U2.P$6
  Bottom 0.254: v33.75,7.88 33.75,4.88 32.85,2.88 LED2.P$6
N$7
  Top 0.61: LED3.C 61.26,32.23 Q2.D
  Top 1.016: X1.1 62.63,39.26 60.25,36.88 60.25,33.24 Q2.D
N$8
  Top 0.61: IC2.2 48.19,34.65 C4.1
  Top 0.813: FB1-ILBB0805.2 48.98,35.4 C4.1
N$9
  Top 0.813: FB2.1 41.69,40.82 42.25,41.38 44.85,41.38 X2.2
N$10  (via drill 0.6)
  Top 0.254: v37.05,12.88 37.05,13.78 36.55,14.28 U2.P$22
  Bottom 0.254: v37.05,12.88 37.05,8.88 42.25,3.38 LED2.P$2
N$11  (via drill 0.6)
  Top 0.254: v38.25,13.38 37.75,13.88 37.75,15.38 U2.P$21
  Bottom 0.254: v38.25,13.38 45.75,5.88 45.75,3.38 LED2.P$1
N$12
  Top 0.61: U2.P$20 39.09,17.06 LED2.P$12
N$13  (via drill 0.6)
  Top 0.254: v35.25,8.88 40.25,13.88 40.25,15.38 U2.P$19
  Bottom 0.254: v35.25,8.88 35.25,3.38 LED2.P$5
N$14
  Top 0.61: IC2.3 46.92,34.65 C4.2 43.78,35.42 FB2.2
N$16  (via drill 0.6)
  Top 0.254: v36.75,7.38 41.75,12.38 41.75,15.38 U2.P$18
  Bottom 0.254: v36.75,7.38 36.75,6.38 39.75,3.38 LED2.P$3
N$20  (via drill 0.6)
  Top 0.61: v13.25,26.88 12.75,26.38 10.25,26.38 C8.2 | IC5.20 18.44,26.07 v19.25,26.88
  Bottom 0.61: v13.25,26.88 v19.25,26.88
N$26
  Top 0.813: LED4.A 14.03,29.35 R7.1
N$31
  Top 0.61: IC5.7 20.04,13.67 17.25,10.88 16.03,10.88 Q4.2 15.67,10.51 C12.2
N$32
  Top 0.61: IC5.8 20.84,10.85 Q4.1 20.67,10.53 C13.2
N$45
  Top 0.61: LED3.A 64.13,26.36 R9.1
N$47
  Top 0.61: Q2.G 57.73,30.23 R4.1
RESET  (via drill 0.6)
  Top 0.305: IC5.29 13.15,20.38 12.05,19.28 10.35,19.28 10.15,19.48 10.15,20.37 R15.2 10.04,20.48 v8.15,20.48
  Bottom 0.305: J1.5 5.05,15 5.05,20.08 5.37,20.4 8.07,20.4 v8.15,20.48
SCK
  Top 0.61: R6.2 D3.A 43.37,20.76 42.75,21.38 42.75,26.38 43.25,26.88 45.41,26.88 IC2.5
VCC  (via drill 0.6)
  Top 0.406: v55.55,25.18 57.95,22.78 C1.1 | v51.15,26.08 51.15,26.88 48.95,29.08 45.95,29.08 45.35,29.68 42.65,29.68 v41.95,28.98 | v34.05,29.38 32.65,30.78 31.55,30.78 R13.2 | R8.2 57.97,8.58 R10.2 R11.2 62.75,11.68 67.85,16.78 | 31.11,30.88 29.85,30.88 28.45,32.28 28.15,32.28 27.25,33.18
  Top 0.61: 4.65,25.38 IC3.3 4.81,27.38 6.25,27.38 7.25,28.38 7.25,32.38 8.41,33.54 IC1.3 | 4.65,25.38 C11.2 4.66,22.47 6.25,20.88 6.25,18.88 J1.2 7.82,18.81 9.25,17.38 9.94,17.38 R15.1 | IC3.1 2.75,25.88 3.25,25.38 4.65,25.38 | C5.1 10.11,17.54 R15.1 | IC5.6 19.24,18.37 19.25,18.38 18.75,18.88 | 18.75,18.88 18.25,18.88 | 18.25,18.88 17.64,18.27 IC5.4 | C6.+ 26.68,43.45 27.25,42.88 27.25,33.18 | 31.11,30.88 R13.2 31.25,30.74 31.25,23.38 29.44,21.57 R2.2 25.92,21.53 25.92,20.08 | S1.3 S1.4 72.35,34.58 72.35,35.88 71.75,36.78 67.95,36.78 66.88,35.01 SELECT.1 | SELECT.1 58.75,22.16 C1.1 | SET.A 68.08,16.55 67.85,16.78 66.75,17.88 66.75,22.03 SELECT.1 | R1.2 25.92,20.08 | IC5.18 20.04,22.17 18.75,20.88 18.75,20.38 | 18.75,19.38 18.75,18.88 | U2.P$28 28.93,16.69 27.15,18.48 25.9,18.48 R1.2 | v11.95,17.38 10.25,17.38 R15.1 | 18.25,18.88 18.75,19.38 | 18.75,19.38 18.75,20.38 | v20.25,20.38 18.75,20.38 | 25.75,18.38 R1.2 | v25.15,20.08 25.92,20.08
  Bottom 0.406: v55.55,25.18 52.05,25.18 v51.15,26.08 | v41.95,28.98 41.35,28.68 34.75,28.68 v34.05,29.38
  Bottom 0.61: v11.95,17.38 14.95,20.38 v20.25,20.38 24.35,20.38 v25.15,20.08